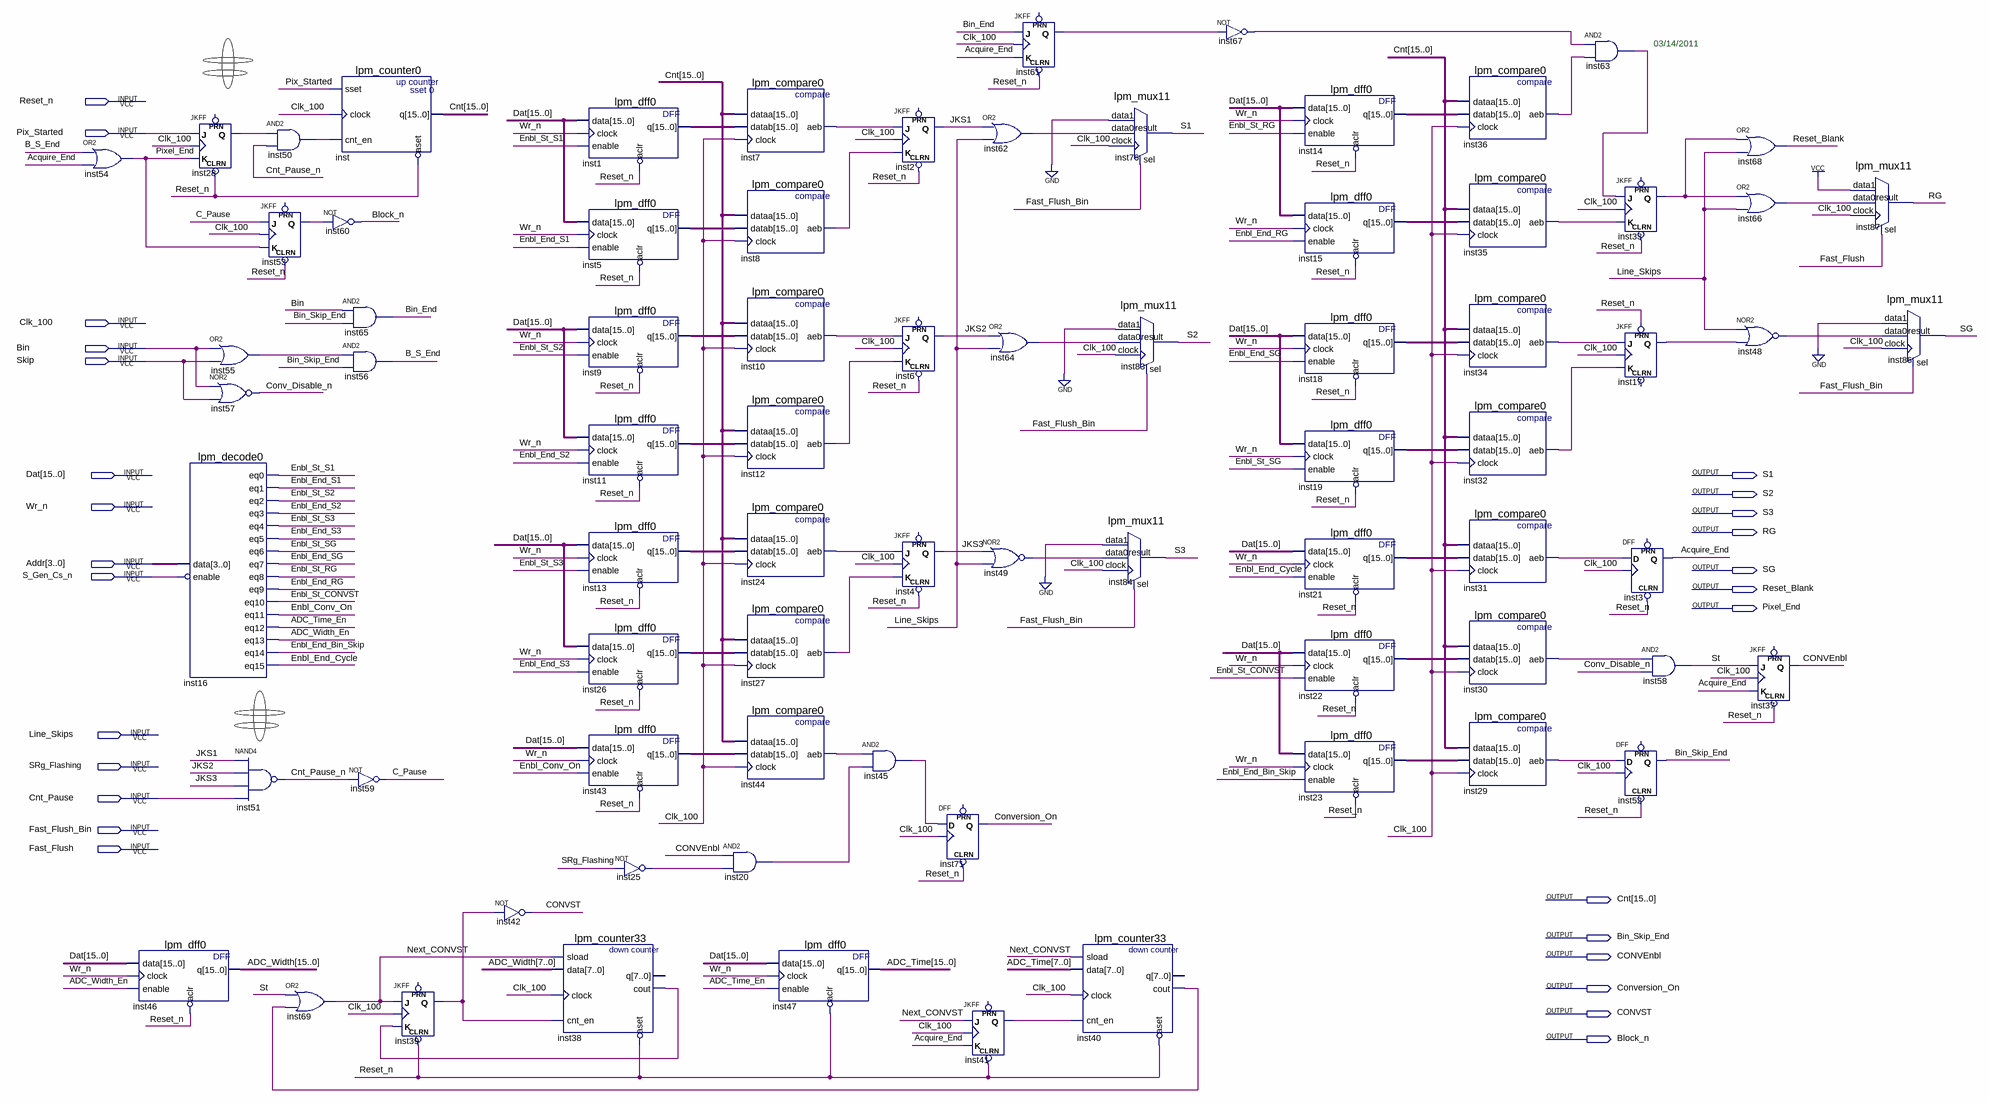
[diagram p0: schematic sheet]
// Quartus schematic Serial_Clocks_Generator.bdf as structural Verilog: 76 symbols, 27 pins
module Serial_Clocks_Generator (
  input  Reset_n,
  input  Pix_Started,
  input  Clk_100,
  input  Bin,
  input  Skip,
  input  [15:0] Dat,
  input  Wr_n,
  input  [3:0] Addr,
  input  S_Gen_Cs_n,
  input  Line_Skips,
  input  SRg_Flashing,
  input  Cnt_Pause,
  input  Fast_Flush_Bin,
  input  Fast_Flush,
  output S1,
  output S2,
  output S3,
  output RG,
  output SG,
  output Reset_Blank,
  output Pixel_End,
  output [15:0] Cnt,
  output Bin_Skip_End,
  output CONVEnbl,
  output Conversion_On,
  output CONVST,
  output Block_n
);

  wire Acquire_End, ADC_Time_En, ADC_Width_En, B_S_End, Bin_End, C_Pause, Cnt_Pause_n, Conv_Disable_n,
       Enbl_Conv_On, Enbl_End_Bin_Skip, Enbl_End_Cycle, Enbl_End_RG, Enbl_End_S1, Enbl_End_S2, Enbl_End_S3,
       Enbl_End_SG, Enbl_St_CONVST, Enbl_St_RG, Enbl_St_S1, Enbl_St_S2, Enbl_St_S3, Enbl_St_SG, inst7_aeb,
       inst8_aeb, inst10_aeb, inst12_aeb, inst17_q, inst20_out, inst24_aeb, inst25_out, inst27_aeb, inst28_q,
       inst29_aeb, inst30_aeb, inst31_aeb, inst32_aeb, inst33_q, inst34_aeb, inst35_aeb, inst36_aeb,
       inst38_cout, inst39_q, inst40_cout, inst41_q, inst44_aeb, inst45_out, inst48_out, inst49_out,
       inst50_out, inst53_q, inst55_out, inst61_q, inst62_out, inst63_out, inst64_out, inst66_out,
       inst67_out, JKS1, JKS2, JKS3, Next_CONVST, St;
  wire [15:0] ADC_Time, ADC_Width, inst1_q, inst5_q, inst9_q, inst11_q, inst13_q, inst14_q, inst15_q,
       inst18_q, inst19_q, inst21_q, inst22_q, inst23_q, inst26_q, inst43_q;

  or inst54 (Pixel_End, B_S_End, Acquire_End);
  lpm_dff0 inst46 (.data(Dat), .clock(Wr_n), .enable(ADC_Width_En), .aclr(~Reset_n), .q(ADC_Width));
  JKFF inst28 (.CLRN(Reset_n), .K(Pixel_End), .J(Pix_Started), .CLK(Clk_100), .Q(inst28_q));  // open: PRN
  lpm_decode0 inst16 (
    .data(Addr), .enable(~S_Gen_Cs_n), .eq0(Enbl_St_S1), .eq1(Enbl_End_S1), .eq2(Enbl_St_S2),
    .eq3(Enbl_End_S2), .eq4(Enbl_St_S3), .eq5(Enbl_End_S3), .eq6(Enbl_St_SG), .eq7(Enbl_End_SG),
    .eq8(Enbl_St_RG), .eq9(Enbl_End_RG), .eq10(Enbl_St_CONVST), .eq11(Enbl_Conv_On), .eq12(ADC_Time_En),
    .eq13(ADC_Width_En), .eq14(Enbl_End_Bin_Skip), .eq15(Enbl_End_Cycle));
  or inst55 (inst55_out, Bin, Skip);
  nor inst57 (Conv_Disable_n, Bin, Skip);
  nand inst51 (Cnt_Pause_n, JKS1, JKS2, JKS3, Cnt_Pause);
  and inst50 (inst50_out, inst28_q, Cnt_Pause_n);
  JKFF inst53 (.CLRN(Reset_n), .K(Pixel_End), .J(C_Pause), .CLK(Clk_100), .Q(inst53_q));  // open: PRN
  or inst69 (Next_CONVST, St, inst40_cout);
  lpm_counter0 inst (.sset(Pix_Started), .clock(Clk_100), .cnt_en(inst50_out), .aset(~Reset_n), .q(Cnt));
  not inst60 (Block_n, inst53_q);
  and inst65 (Bin_End, Bin, Bin_Skip_End);
  and inst56 (B_S_End, inst55_out, Bin_Skip_End);
  not inst59 (C_Pause, Cnt_Pause_n);
  JKFF inst39 (.CLRN(Reset_n), .K(inst38_cout), .J(Next_CONVST), .CLK(Clk_100), .Q(inst39_q));  // open: PRN
  not inst42 (CONVST, inst39_q);
  lpm_dff0 inst1 (.data(Dat), .clock(Wr_n), .enable(Enbl_St_S1), .aclr(~Reset_n), .q(inst1_q));
  lpm_dff0 inst5 (.data(Dat), .clock(Wr_n), .enable(Enbl_End_S1), .aclr(~Reset_n), .q(inst5_q));
  lpm_dff0 inst9 (.data(Dat), .clock(Wr_n), .enable(Enbl_St_S2), .aclr(~Reset_n), .q(inst9_q));
  lpm_dff0 inst11 (.data(Dat), .clock(Wr_n), .enable(Enbl_End_S2), .aclr(~Reset_n), .q(inst11_q));
  lpm_dff0 inst13 (.data(Dat), .clock(Wr_n), .enable(Enbl_St_S3), .aclr(~Reset_n), .q(inst13_q));
  lpm_dff0 inst26 (.data(Dat), .clock(Wr_n), .enable(Enbl_End_S3), .aclr(~Reset_n), .q(inst26_q));
  lpm_dff0 inst43 (.data(Dat), .clock(Wr_n), .enable(Enbl_Conv_On), .aclr(~Reset_n), .q(inst43_q));
  lpm_counter33 inst38 (
    .sload(Next_CONVST), .data(ADC_Width[7:0]), .clock(Clk_100), .cnt_en(inst39_q), .aset(~Reset_n),
    .cout(inst38_cout));  // open: q
  not inst25 (inst25_out, SRg_Flashing);
  lpm_compare0 inst7 (.dataa(Cnt), .datab(inst1_q), .clock(Clk_100), .aeb(inst7_aeb));
  lpm_compare0 inst8 (.dataa(Cnt), .datab(inst5_q), .clock(Clk_100), .aeb(inst8_aeb));
  lpm_compare0 inst10 (.dataa(Cnt), .datab(inst9_q), .clock(Clk_100), .aeb(inst10_aeb));
  lpm_compare0 inst12 (.dataa(Cnt), .datab(inst11_q), .clock(Clk_100), .aeb(inst12_aeb));
  lpm_compare0 inst24 (.dataa(Cnt), .datab(inst13_q), .clock(Clk_100), .aeb(inst24_aeb));
  lpm_compare0 inst27 (.dataa(Cnt), .datab(inst26_q), .clock(Clk_100), .aeb(inst27_aeb));
  lpm_compare0 inst44 (.dataa(Cnt), .datab(inst43_q), .clock(Clk_100), .aeb(inst44_aeb));
  and inst20 (inst20_out, CONVEnbl, inst25_out);
  lpm_dff0 inst47 (.data(Dat), .clock(Wr_n), .enable(ADC_Time_En), .aclr(~Reset_n), .q(ADC_Time));
  JKFF inst2 (.CLRN(Reset_n), .K(inst8_aeb), .J(inst7_aeb), .CLK(Clk_100), .Q(JKS1));  // open: PRN
  JKFF inst6 (.CLRN(Reset_n), .K(inst12_aeb), .J(inst10_aeb), .CLK(Clk_100), .Q(JKS2));  // open: PRN
  JKFF inst4 (.CLRN(Reset_n), .K(inst27_aeb), .J(inst24_aeb), .CLK(Clk_100), .Q(JKS3));  // open: PRN
  and inst45 (inst45_out, inst44_aeb, inst20_out);
  DFF inst71 (.CLRN(Reset_n), .CLK(Clk_100), .D(inst45_out), .Q(Conversion_On));  // open: PRN
  or inst62 (inst62_out, JKS1, Line_Skips);
  or inst64 (inst64_out, JKS2, Line_Skips);
  nor inst49 (inst49_out, JKS3, Line_Skips);
  JKFF inst41 (.CLRN(Reset_n), .K(Acquire_End), .J(Next_CONVST), .CLK(Clk_100), .Q(inst41_q));  // open: PRN
  JKFF inst61 (.CLRN(Reset_n), .K(Acquire_End), .J(Bin_End), .CLK(Clk_100), .Q(inst61_q));  // open: PRN
  lpm_mux11 inst84 (.data1(1'b0), .data0(inst49_out), .clock(Clk_100), .sel(Fast_Flush_Bin), .result(S3));
  lpm_counter33 inst40 (
    .sload(Next_CONVST), .data(ADC_Time[7:0]), .clock(Clk_100), .cnt_en(inst41_q), .aset(~Reset_n),
    .cout(inst40_cout));  // open: q
  lpm_mux11 inst76 (.data1(1'b0), .data0(inst62_out), .clock(Clk_100), .sel(Fast_Flush_Bin), .result(S1));
  lpm_mux11 inst83 (.data1(1'b0), .data0(inst64_out), .clock(Clk_100), .sel(Fast_Flush_Bin), .result(S2));
  not inst67 (inst67_out, inst61_q);
  lpm_dff0 inst14 (.data(Dat), .clock(Wr_n), .enable(Enbl_St_RG), .aclr(~Reset_n), .q(inst14_q));
  lpm_dff0 inst15 (.data(Dat), .clock(Wr_n), .enable(Enbl_End_RG), .aclr(~Reset_n), .q(inst15_q));
  lpm_dff0 inst18 (.data(Dat), .clock(Wr_n), .enable(Enbl_End_SG), .aclr(~Reset_n), .q(inst18_q));
  lpm_dff0 inst19 (.data(Dat), .clock(Wr_n), .enable(Enbl_St_SG), .aclr(~Reset_n), .q(inst19_q));
  lpm_dff0 inst21 (.data(Dat), .clock(Wr_n), .enable(Enbl_End_Cycle), .aclr(~Reset_n), .q(inst21_q));
  lpm_dff0 inst22 (.data(Dat), .clock(Wr_n), .enable(Enbl_St_CONVST), .aclr(~Reset_n), .q(inst22_q));
  lpm_dff0 inst23 (.data(Dat), .clock(Wr_n), .enable(Enbl_End_Bin_Skip), .aclr(~Reset_n), .q(inst23_q));
  lpm_compare0 inst36 (.dataa(Cnt), .datab(inst14_q), .clock(Clk_100), .aeb(inst36_aeb));
  lpm_compare0 inst35 (.dataa(Cnt), .datab(inst15_q), .clock(Clk_100), .aeb(inst35_aeb));
  lpm_compare0 inst34 (.dataa(Cnt), .datab(inst18_q), .clock(Clk_100), .aeb(inst34_aeb));
  lpm_compare0 inst32 (.dataa(Cnt), .datab(inst19_q), .clock(Clk_100), .aeb(inst32_aeb));
  lpm_compare0 inst31 (.dataa(Cnt), .datab(inst21_q), .clock(Clk_100), .aeb(inst31_aeb));
  lpm_compare0 inst30 (.dataa(Cnt), .datab(inst22_q), .clock(Clk_100), .aeb(inst30_aeb));
  lpm_compare0 inst29 (.dataa(Cnt), .datab(inst23_q), .clock(Clk_100), .aeb(inst29_aeb));
  and inst63 (inst63_out, inst67_out, inst36_aeb);
  JKFF inst33 (.CLRN(Reset_n), .K(inst35_aeb), .J(inst63_out), .CLK(Clk_100), .Q(inst33_q));  // open: PRN
  JKFF inst17 (.PRN(Reset_n), .K(inst32_aeb), .J(inst34_aeb), .CLK(Clk_100), .Q(inst17_q));  // open: CLRN
  DFF inst3 (.CLRN(Reset_n), .CLK(Clk_100), .D(inst31_aeb), .Q(Acquire_End));  // open: PRN
  and inst58 (St, inst30_aeb, Conv_Disable_n);
  DFF inst52 (.CLRN(Reset_n), .CLK(Clk_100), .D(inst29_aeb), .Q(Bin_Skip_End));  // open: PRN
  or inst68 (Reset_Blank, inst33_q, Line_Skips);
  or inst66 (inst66_out, inst33_q, Line_Skips);
  nor inst48 (inst48_out, Line_Skips, inst17_q);
  JKFF inst37 (.CLRN(Reset_n), .K(Acquire_End), .J(St), .CLK(Clk_100), .Q(CONVEnbl));  // open: PRN
  lpm_mux11 inst87 (.data1(1'b1), .data0(inst66_out), .clock(Clk_100), .sel(Fast_Flush), .result(RG));
  lpm_mux11 inst86 (.data1(1'b0), .data0(inst48_out), .clock(Clk_100), .sel(Fast_Flush_Bin), .result(SG));

  // Notes on the sheet:
  //   03/14/2011
endmodule
